# Altium schematic sheet analog filters.SchDoc
size A4; SheetNumber: 3; SheetTotal: 6
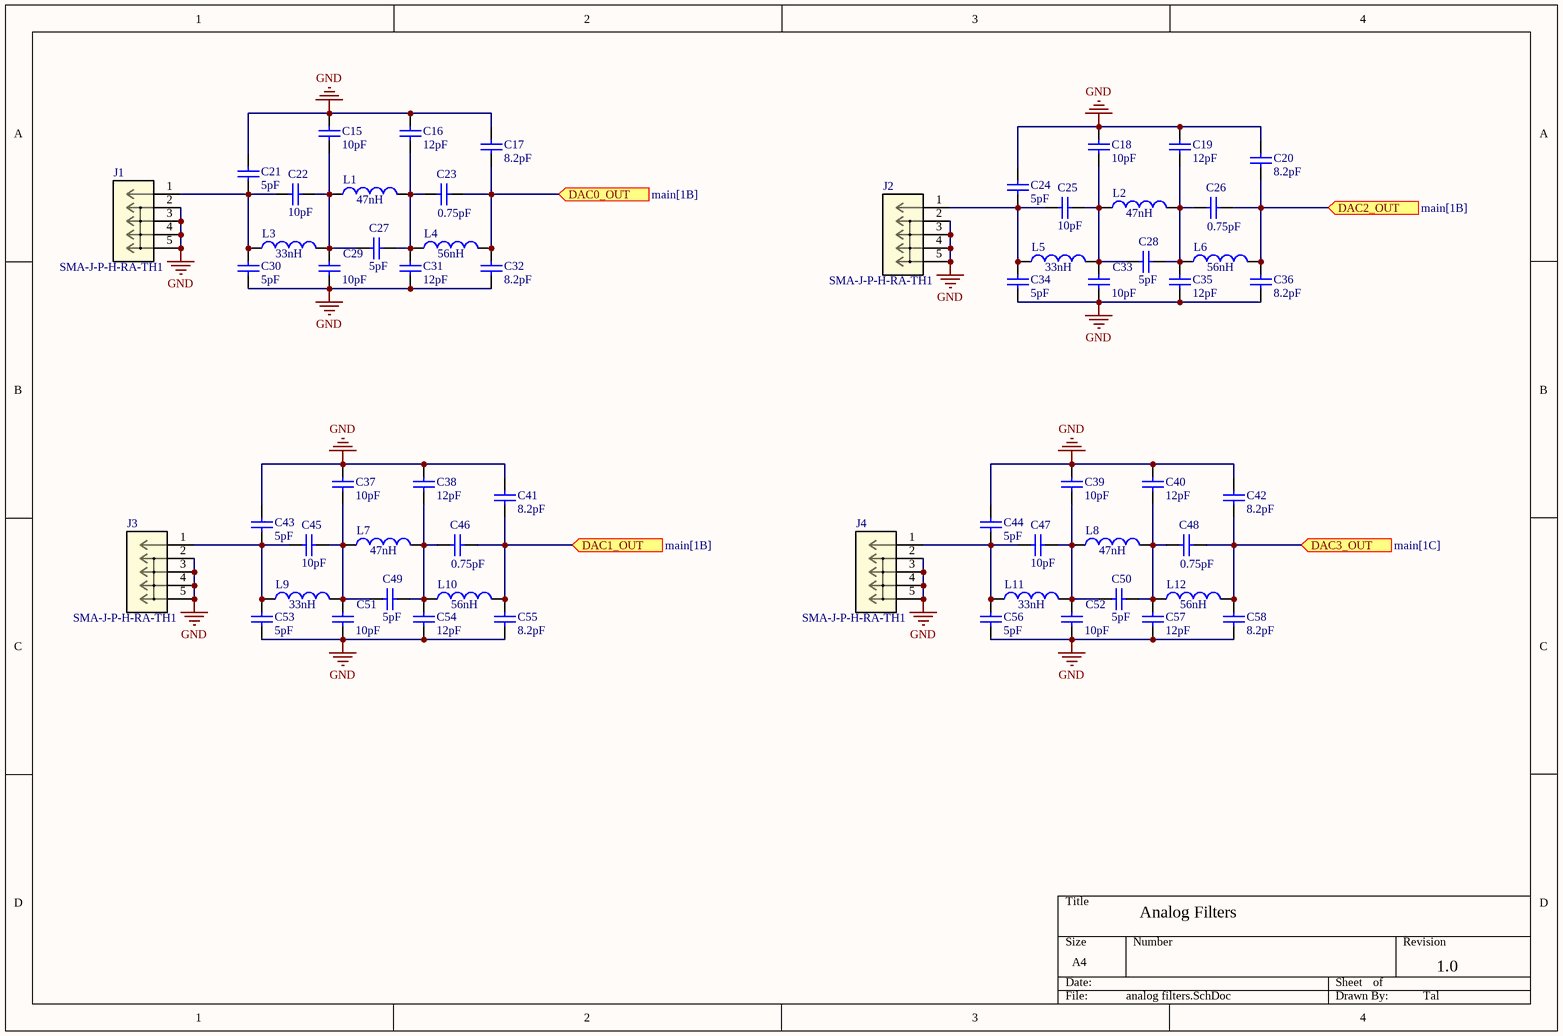
[diagram p0: analog filters.SchDoc]

## Parts
C15  Capacitance: 10pF  [C0402]  (hidden comment: 10pF 50V)
C16  Capacitance: 12pF  [C0402]  (hidden comment: 12pF 50V)
C17  Capacitance: 8.2pF  [C0402]  (hidden comment: 8.2pF 50V)
C18  Capacitance: 10pF  [C0402]  (hidden comment: 10pF 50V)
C19  Capacitance: 12pF  [C0402]  (hidden comment: 12pF 50V)
C20  Capacitance: 8.2pF  [C0402]  (hidden comment: 8.2pF 50V)
C21  Capacitance: 5pF  [C0402]  (hidden comment: 5pF 50V)
C22  Capacitance: 10pF  [C0402]  (hidden comment: 10pF 50V)
C23  Capacitance: 0.75pF  [C0402]  (hidden comment: 0.75pF 50V)
C24  Capacitance: 5pF  [C0402]  (hidden comment: 5pF 50V)
C25  Capacitance: 10pF  [C0402]  (hidden comment: 10pF 50V)
C26  Capacitance: 0.75pF  [C0402]  (hidden comment: 0.75pF 50V)
C27  Capacitance: 5pF  [C0402]  (hidden comment: 5pF 50V)
C28  Capacitance: 5pF  [C0402]  (hidden comment: 5pF 50V)
C29  Capacitance: 10pF  [C0402]  (hidden comment: 10pF 50V)
C30  Capacitance: 5pF  [C0402]  (hidden comment: 5pF 50V)
C31  Capacitance: 12pF  [C0402]  (hidden comment: 12pF 50V)
C32  Capacitance: 8.2pF  [C0402]  (hidden comment: 8.2pF 50V)
C33  Capacitance: 10pF  [C0402]  (hidden comment: 10pF 50V)
C34  Capacitance: 5pF  [C0402]  (hidden comment: 5pF 50V)
C35  Capacitance: 12pF  [C0402]  (hidden comment: 12pF 50V)
C36  Capacitance: 8.2pF  [C0402]  (hidden comment: 8.2pF 50V)
C37  Capacitance: 10pF  [C0402]  (hidden comment: 10pF 50V)
C38  Capacitance: 12pF  [C0402]  (hidden comment: 12pF 50V)
C39  Capacitance: 10pF  [C0402]  (hidden comment: 10pF 50V)
C40  Capacitance: 12pF  [C0402]  (hidden comment: 12pF 50V)
C41  Capacitance: 8.2pF  [C0402]  (hidden comment: 8.2pF 50V)
C42  Capacitance: 8.2pF  [C0402]  (hidden comment: 8.2pF 50V)
C43  Capacitance: 5pF  [C0402]  (hidden comment: 5pF 50V)
C44  Capacitance: 5pF  [C0402]  (hidden comment: 5pF 50V)
C45  Capacitance: 10pF  [C0402]  (hidden comment: 10pF 50V)
C46  Capacitance: 0.75pF  [C0402]  (hidden comment: 0.75pF 50V)
C47  Capacitance: 10pF  [C0402]  (hidden comment: 10pF 50V)
C48  Capacitance: 0.75pF  [C0402]  (hidden comment: 0.75pF 50V)
C49  Capacitance: 5pF  [C0402]  (hidden comment: 5pF 50V)
C50  Capacitance: 5pF  [C0402]  (hidden comment: 5pF 50V)
C51  Capacitance: 10pF  [C0402]  (hidden comment: 10pF 50V)
C52  Capacitance: 10pF  [C0402]  (hidden comment: 10pF 50V)
C53  Capacitance: 5pF  [C0402]  (hidden comment: 5pF 50V)
C54  Capacitance: 12pF  [C0402]  (hidden comment: 12pF 50V)
C55  Capacitance: 8.2pF  [C0402]  (hidden comment: 8.2pF 50V)
C56  Capacitance: 5pF  [C0402]  (hidden comment: 5pF 50V)
C57  Capacitance: 12pF  [C0402]  (hidden comment: 12pF 50V)
C58  Capacitance: 8.2pF  [C0402]  (hidden comment: 8.2pF 50V)
J1  SMA-J-P-H-RA-TH1  [CONN_SMA-J-P-H-RA-TH1_SAI]
J2  SMA-J-P-H-RA-TH1  [CONN_SMA-J-P-H-RA-TH1_SAI]
J3  SMA-J-P-H-RA-TH1  [CONN_SMA-J-P-H-RA-TH1_SAI]
J4  SMA-J-P-H-RA-TH1  [CONN_SMA-J-P-H-RA-TH1_SAI]
L1  value 47nH  [0402-A]  (hidden comment: Inductor)
L2  value 47nH  [0402-A]  (hidden comment: Inductor)
L3  value 33nH  [0402-A]  (hidden comment: Inductor)
L4  value 56nH  [0402-A]  (hidden comment: Inductor)
L5  value 33nH  [0402-A]  (hidden comment: Inductor)
L6  value 56nH  [0402-A]  (hidden comment: Inductor)
L7  value 47nH  [0402-A]  (hidden comment: Inductor)
L8  value 47nH  [0402-A]  (hidden comment: Inductor)
L9  value 33nH  [0402-A]  (hidden comment: Inductor)
L10  value 56nH  [0402-A]  (hidden comment: Inductor)
L11  value 33nH  [0402-A]  (hidden comment: Inductor)
L12  value 56nH  [0402-A]  (hidden comment: Inductor)

## Ports
DAC0_OUT (in, see main[1B]), DAC1_OUT (in, see main[1B]), DAC2_OUT (in, see main[1B]), DAC3_OUT (in, see main[1C])

## Nets
GND: C15.2 C16.2 C17.2 C18.2 C19.2 C20.2 C21.2 C24.2 C29.1 C30.1 C31.1 C32.1 C33.1 C34.1 C35.1 C36.1 C37.2 C38.2 C39.2 C40.2 C41.2 C42.2 C43.2 C44.2 C51.1 C52.1 C53.1 C54.1 C55.1 C56.1 C57.1 C58.1 J1.2 J1.3 J1.4 J1.5 J2.2 J2.3 J2.4 J2.5 J3.2 J3.3 J3.4 J3.5 J4.2 J4.3 J4.4 J4.5
DAC0_OUT: C17.1 C23.2 C32.2 L4.2 ; port DAC0_OUT
DAC1_OUT: C41.1 C46.2 C55.2 L10.2 ; port DAC1_OUT
DAC2_OUT: C20.1 C26.2 C36.2 L6.2 ; port DAC2_OUT
DAC3_OUT: C42.1 C48.2 C58.2 L12.2 ; port DAC3_OUT
NetC15_1: C15.1 C22.1 C27.2 C29.2 L1.1 L3.2
NetC16_1: C16.1 C23.1 C27.1 C31.2 L1.2 L4.1
NetC18_1: C18.1 C25.1 C28.2 C33.2 L2.1 L5.2
NetC19_1: C19.1 C26.1 C28.1 C35.2 L2.2 L6.1
NetC21_1: C21.1 C22.2 C30.2 J1.1 L3.1
NetC24_1: C24.1 C25.2 C34.2 J2.1 L5.1
NetC37_1: C37.1 C45.1 C49.2 C51.2 L7.1 L9.2
NetC38_1: C38.1 C46.1 C49.1 C54.2 L7.2 L10.1
NetC39_1: C39.1 C47.1 C50.2 C52.2 L8.1 L11.2
NetC40_1: C40.1 C48.1 C50.1 C57.2 L8.2 L12.1
NetC43_1: C43.1 C45.2 C53.2 J3.1 L9.1
NetC44_1: C44.1 C47.2 C56.2 J4.1 L11.1

## Notes on the sheet
- Analog Filters
- 1.0
- Tal

## Library data of the parts
C15 C18 C22 C25 C29 C33 C37 C39 C45 C47 C51 C52 = CAP CER 20pF 50V 5% NP0 0402: CAP CER 10PF 50V 5% NP0 0402; Manufacturer: TDK Corporation; Manufacturer Part Number: C1005C0G1H200J; LANDA P/N: ECP-000034; Package / Case: 0402 (1005 Metric); RoHS: RoHS Compliant; ComponentLink1URL: http://www.tdk.com/pdf/general_B11.pdf; ComponentLink1Description: http://www.tdk.com/pdf/general_B11.pdf; Voltage - Rated: 50V
C16 C19 C31 C35 C38 C40 C54 C57 = CAP CER 20pF 50V 5% NP0 0402: CAP CER 12PF 50V 5% NP0 0402; Manufacturer: TDK Corporation; Manufacturer Part Number: C1005C0G1H200J; LANDA P/N: ECP-000034; Package / Case: 0402 (1005 Metric); RoHS: RoHS Compliant; ComponentLink1URL: http://www.tdk.com/pdf/general_B11.pdf; ComponentLink1Description: http://www.tdk.com/pdf/general_B11.pdf; Voltage - Rated: 50V
C17 C20 C32 C36 C41 C42 C55 C58 = CAP CER 20pF 50V 5% NP0 0402: CAP CER 8.2PF 50V 5% NP0 0402; Manufacturer: TDK Corporation; Manufacturer Part Number: C1005C0G1H200J; LANDA P/N: ECP-000034; Package / Case: 0402 (1005 Metric); RoHS: RoHS Compliant; ComponentLink1URL: http://www.tdk.com/pdf/general_B11.pdf; ComponentLink1Description: http://www.tdk.com/pdf/general_B11.pdf; Voltage - Rated: 50V
C21 C24 C27 C28 C30 C34 C43 C44 C49 C50 C53 C56 = CAP CER 20pF 50V 5% NP0 0402: CAP CER 5PF 50V 5% NP0 0402; Manufacturer: TDK Corporation; Manufacturer Part Number: C1005C0G1H200J; LANDA P/N: ECP-000034; Package / Case: 0402 (1005 Metric); RoHS: RoHS Compliant; ComponentLink1URL: http://www.tdk.com/pdf/general_B11.pdf; ComponentLink1Description: http://www.tdk.com/pdf/general_B11.pdf; Voltage - Rated: 50V
C23 C26 C46 C48 = CAP CER 20pF 50V 5% NP0 0402: CAP CER 0.75PF 50V 5% NP0 0402; Manufacturer: TDK Corporation; Manufacturer Part Number: C1005C0G1H200J; LANDA P/N: ECP-000034; Package / Case: 0402 (1005 Metric); RoHS: RoHS Compliant; ComponentLink1URL: http://www.tdk.com/pdf/general_B11.pdf; ComponentLink1Description: http://www.tdk.com/pdf/general_B11.pdf; Voltage - Rated: 50V
J1-J4 = SMA-J-P-H-RA-TH1: No Description Available; Mfr_Name: Samtec Inc; Copyright: Copyright (C) 2023 Ultra Librarian. All rights reserved.; Manufacturer_Part_Number: SMA-J-P-H-RA-TH1; RefDes: RefDes; Type: DEV
L1-L12 = Inductor: Code_IEC: 1005; Published: 8-Jun-2000; LatestRevisionDate: 29-May-2009; LatestRevisionNote: IPC-7351 Footprint Added.; PackageReference: 0402-A; Publisher: Altium Limited; PackageDescription: Chip Inductor; Code_JEITA: 0402